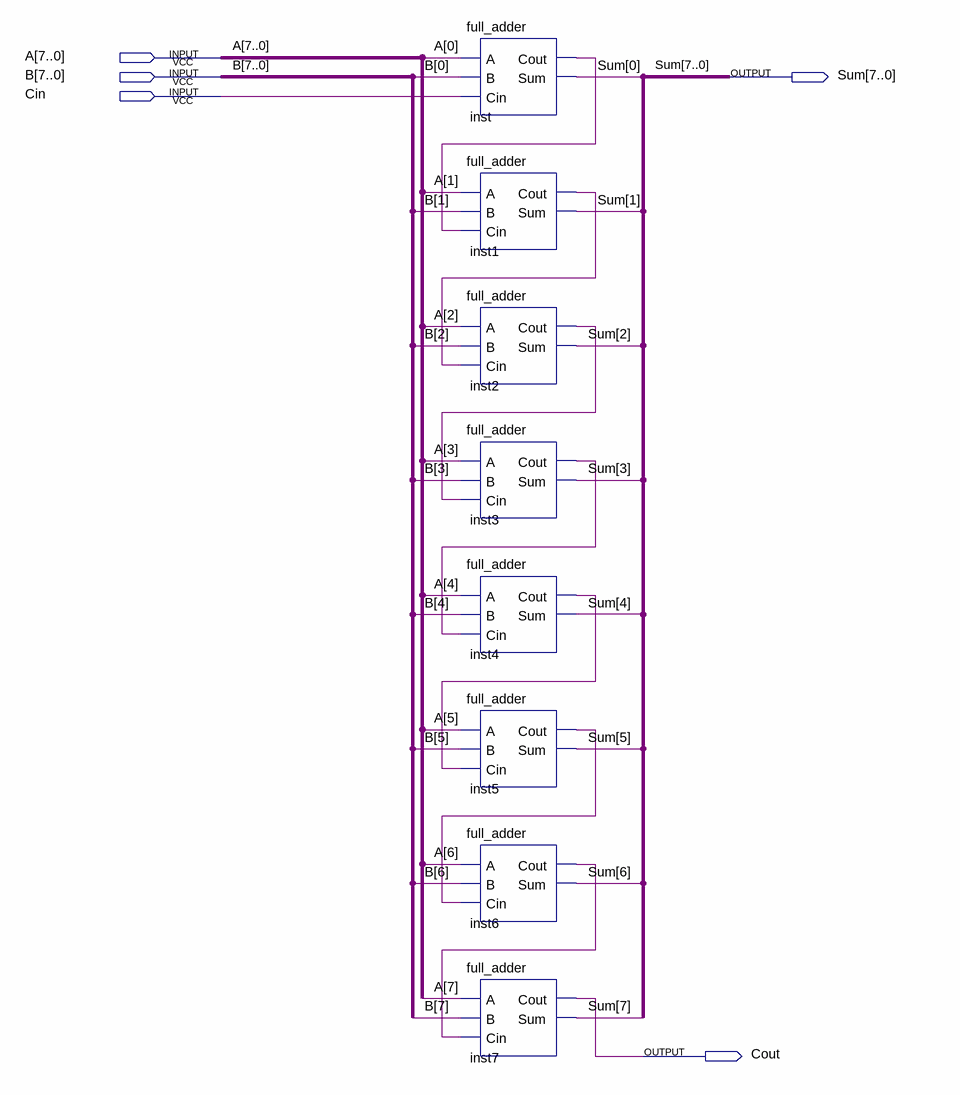
[diagram p0: schematic sheet]
// Quartus schematic ripple_adder_8bit.bdf as structural Verilog: 8 symbols, 5 pins
module ripple_adder_8bit (
  input  [7:0] A,
  input  [7:0] B,
  input  Cin,
  output [7:0] Sum,
  output Cout
);

  wire inst1_cout, inst2_cout, inst3_cout, inst4_cout, inst5_cout, inst6_cout, inst_cout;

  full_adder inst (.A(A[0]), .B(B[0]), .Cin(Cin), .Cout(inst_cout), .Sum(Sum[0]));
  full_adder inst1 (.A(A[1]), .B(B[1]), .Cin(inst_cout), .Cout(inst1_cout), .Sum(Sum[1]));
  full_adder inst2 (.A(A[2]), .B(B[2]), .Cin(inst1_cout), .Cout(inst2_cout), .Sum(Sum[2]));
  full_adder inst3 (.A(A[3]), .B(B[3]), .Cin(inst2_cout), .Cout(inst3_cout), .Sum(Sum[3]));
  full_adder inst4 (.A(A[4]), .B(B[4]), .Cin(inst3_cout), .Cout(inst4_cout), .Sum(Sum[4]));
  full_adder inst5 (.A(A[5]), .B(B[5]), .Cin(inst4_cout), .Cout(inst5_cout), .Sum(Sum[5]));
  full_adder inst6 (.A(A[6]), .B(B[6]), .Cin(inst5_cout), .Cout(inst6_cout), .Sum(Sum[6]));
  full_adder inst7 (.A(A[7]), .B(B[7]), .Cin(inst6_cout), .Cout(Cout), .Sum(Sum[7]));
endmodule
